# EAGLE design adaptor (EAGLE 6.4)
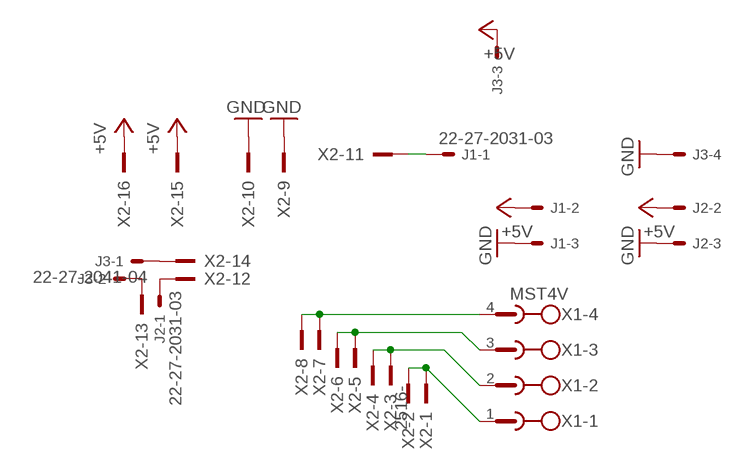
[diagram p0: schematic, sheet 1]

## Parts
J1  22-27-2031-03  [6410-03]
J2  22-27-2031-03  [6410-03]
J3  22-27-2041-04  [6410-04]
X1  MST4V  [MSTBV4]
X2  2516-  [PAK100/2500-16]

## Nets
+5V: J1.2 J2.2 J3.3 X2.15 X2.16
GND: J1.3 J2.3 J3.4 X2.9 X2.10
N$1: X1.4 X2.7 X2.8
N$2: X1.3 X2.5 X2.6
N$3: X1.2 X2.3 X2.4
N$4: X1.1 X2.1 X2.2
N$5: J1.1 X2.11
N$6: J3.1 X2.14
N$7: J2.1 X2.12
N$8: J3.2 X2.13

## Library data of the parts
J1 J2 = con-molex:22-?-03: CONNECTOR wire to board 2.54 mm (.1 inch) pitch header; OC_FARNELL: unknown; OC_NEWARK: unknown
J3 = con-molex:22-?-04: CONNECTOR wire to board 2.54 mm (.1 inch) pitch header; OC_FARNELL: unknown; OC_NEWARK: unknown
X1 = con-phoenix-508:MST4V: PHOENIX; OC_FARNELL: unknown; OC_NEWARK: unknown
X2 = con-3m:2516-: 3M (TM) Pak 100 4-Wall Header Source: 3M; OC_FARNELL: unknown; OC_NEWARK: unknown

## Board
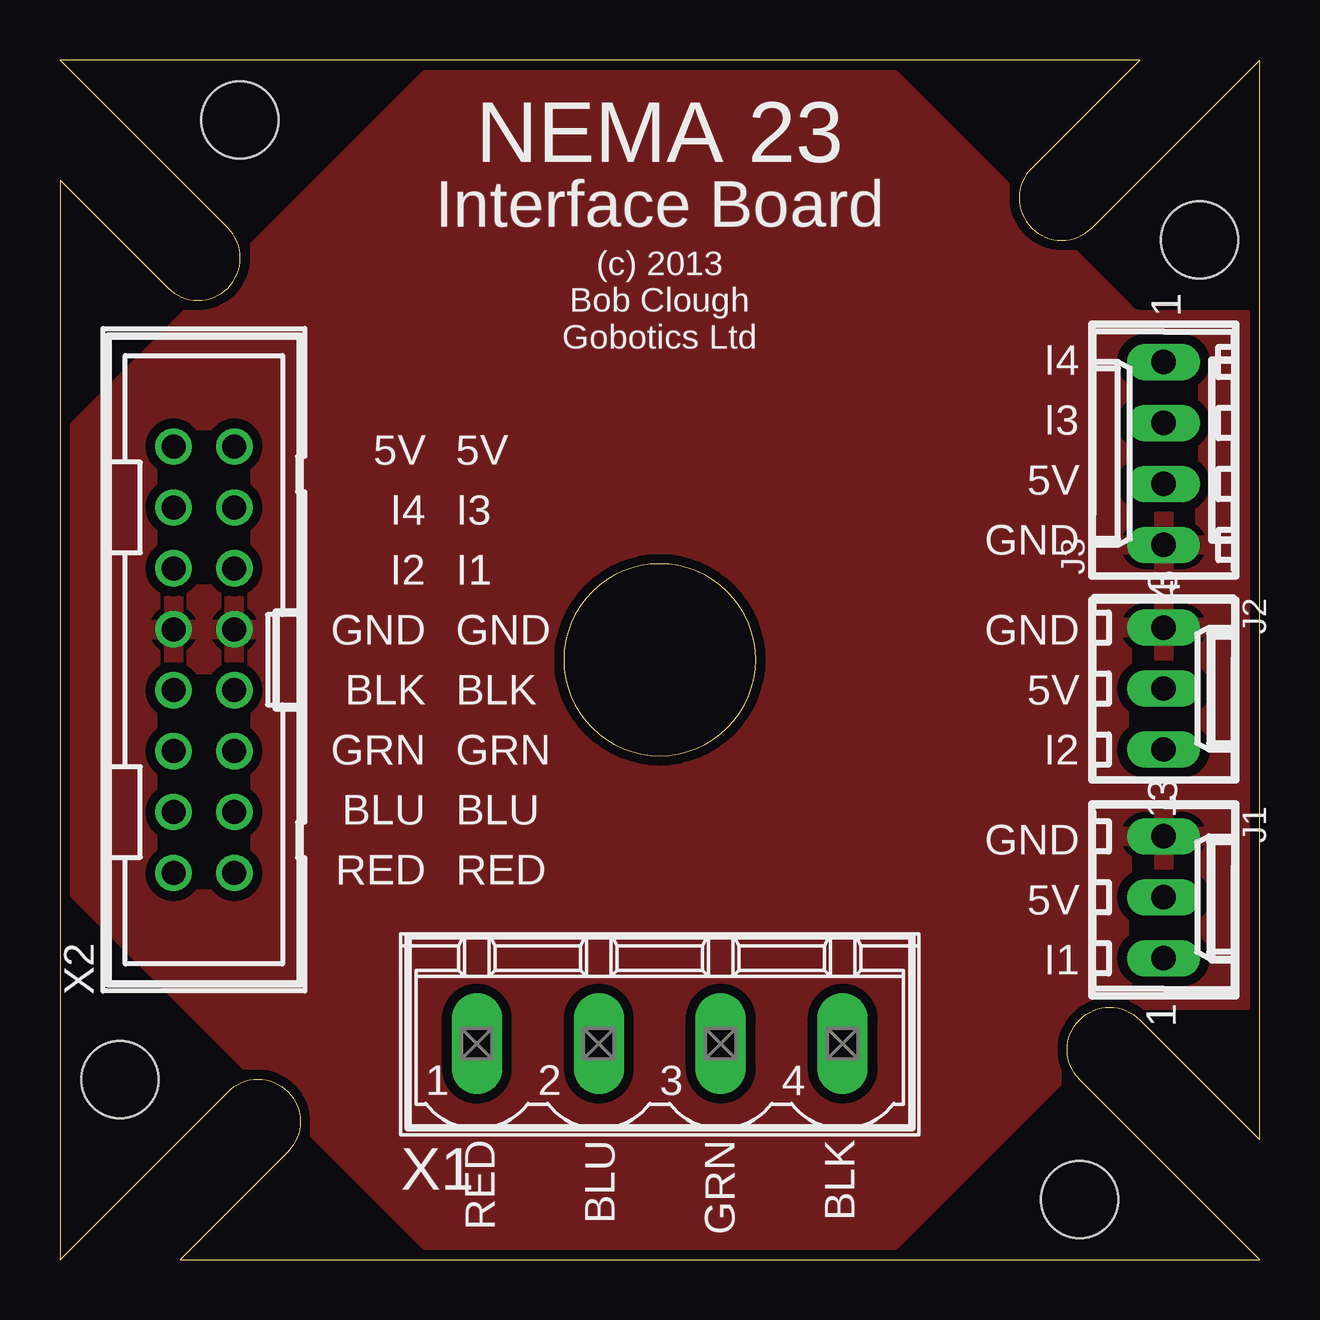
[diagram p1: board, top side]
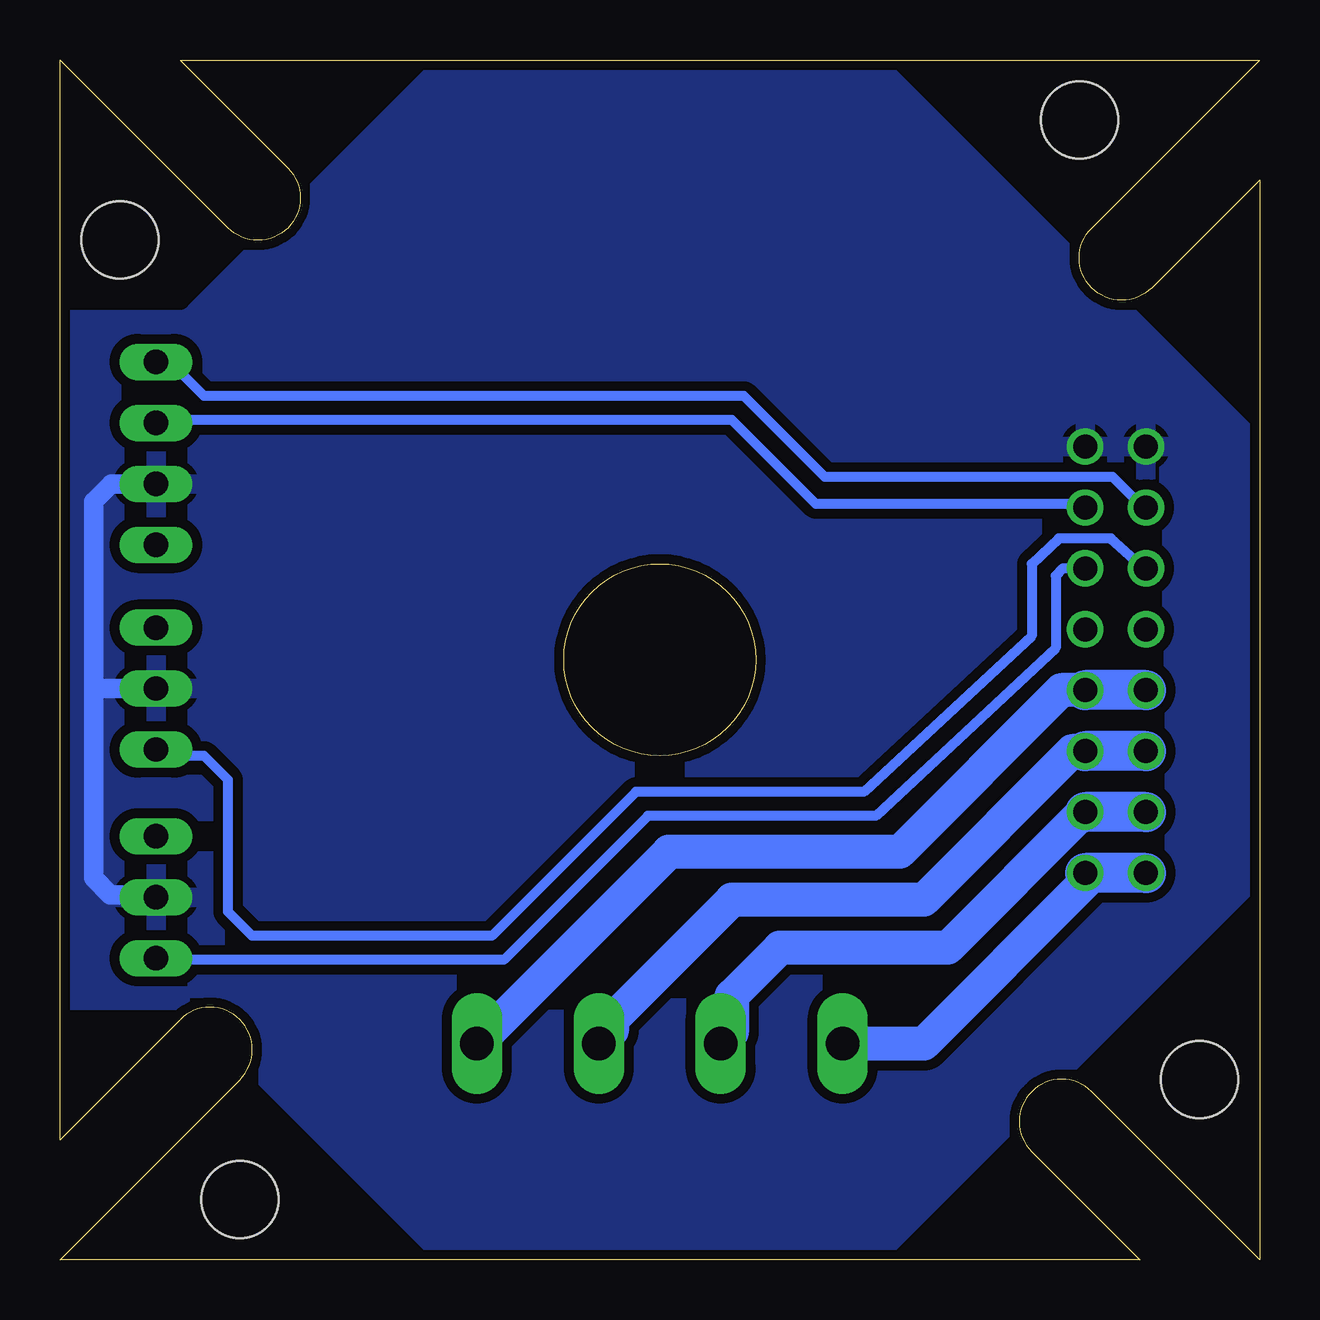
[diagram p2: board, bottom side, seen from below]

Size 50 x 50 mm. Coordinates in mm from the lower left corner, seen from the top.
Outline: 5,0 50,0 42.5,7.5 arc-180 45,10 50,5 50,50 43,43 arc-180 40.5,45.5 45,50 0,50 7,43 arc-180 4.5,40.5 0,45 0,0 7,7 arc-180 9.5,4.5 5,0
Outline: 21,25 arc180 29,25 arc180 21,25
Copper layers (1*16): Top 0.035mm / dielectric 1.5mm / Bottom 0.035mm
Design rules "Seeed Fusion Design Rules": minimum track width 6mil, minimum drill 12mil, track to track 6mil, track to pad 6mil, pad to pad 6mil, via to via 6mil, smd to smd 0mil, copper to edge 10mil, drill to drill 10mil, minimum pad ring 10mil, minimum via ring 6mil, stop-mask expansion 2mil, vias tented up to drill 100mil, thermal gap 10mil
Holes 3.2 mm at 2.5,7.5 7.5,47.5 47.5,42.5 42.5,2.5
tRestrict: area 0,0 to 15,15; area 0,35 to 15,50; area 35,40 to 50,50; area 35,0 to 50,10
bRestrict: area 0,35 to 15,50; area 35,40 to 50,50; area 35,0 to 50,10; area 0,0 to 15,15

### Footprints (pad centres in the part's own frame; a part is rotated, then mirrored left to right if it is on the bottom)
6410-03 = drill 1.016 long: 1 2.54,0; 2 0,0; 3 -2.54,0
6410-04 = drill 1.016 long: 1 3.81,0; 2 1.27,0; 3 -1.27,0; 4 -3.81,0
MSTBV4 = drill 1.397 long: 1 -7.62,0; 2 -2.54,0; 3 2.54,0; 4 7.62,0
PAK100/2500-16 = drill 1 pad 1.422: 1 -8.89,-1.27; 2 -8.89,1.27; 3 -6.35,-1.27; 4 -6.35,1.27; 5 -3.81,-1.27; 6 -3.81,1.27; 7 -1.27,-1.27; 8 -1.27,1.27; 9 1.27,-1.27; 10 1.27,1.27; 11 3.81,-1.27; 12 3.81,1.27; 13 6.35,-1.27; 14 6.35,1.27; 15 8.89,-1.27; 16 8.89,1.27

### Placement (x,y rotation side)
J1  46,15.1 270 top
J2  46,23.8 270 top
J3  46,33.6 90 top
X1  25,9 0 top
X2  6,25 90 top

### Tracks (layer width: path | path; a pad name or v marks a point on that pad's centre or on a via)
+5V
  Bottom 0.813: J3.3 47.87,32.33 48.6,31.6 48.6,23.8 | 48.6,23.8 48.6,15.9 47.9,15.2 46.1,15.2 J1.2 | J2.2 48.6,23.8
  pour Bottom (isolate 0.406): -2,53 53,53 59,47 59,1 48,-10 5,-10 -6,1
GND
  pour Top (isolate 0.406): -2.4,53.4 52.1,53.4 62.8,42.7 62.8,11.3 49.4,-2.1 2.8,-2.1 -4.9,5.6
N$1
  Bottom 1.422: X2.7 8.27,23.73 15,17 24.62,17 X1.4
  Bottom 1.676: X2.8 X2.7
N$2
  Bottom 1.422: X2.5 7.81,21.19 14,15 22,15 27,10 27,9.54 X1.3
  Bottom 1.676: X2.6 X2.5
N$3
  Bottom 1.422: X2.3 7.35,18.65 13,13 20,13 22,11 22,9.46 X1.2
  Bottom 1.676: X2.4 X2.3 | X1.2 22.46,9.54
N$4
  Bottom 1.422: X2.1 7.27,15.73 14,9 X1.1
  Bottom 1.676: X2.2 X2.1
N$5
  Bottom 0.406: X2.11 8.19,28.81 8.5,28.5 8.5,25.5 16,18.5 25.5,18.5 31.5,12.5 45.94,12.5
  Bottom 0.813: 45.94,12.5 J1.1
N$6
  Bottom 0.406: X2.14 4.85,31.35 6.12,32.62 18.12,32.62 21.5,36 44,36 45.5,37.5 45.91,37.5 J3.1
N$7
  Bottom 0.406: X2.12 4.81,28.81 6.19,30.06 8.38,30.06 9.5,29 9.5,26 16.5,19.5 26,19.5 32,13.5 42,13.5 43,14.5 43,20 44,21 45.74,21 J2.1
N$8
  Bottom 0.406: X2.13 7.35,31.35 7.5,31.5 18.5,31.5 22,35 45.87,35 J3.2

### Text on the board
_tsilk: NEMA 23 | Interface Board | (c) 2013 / Bob Clough / Gobotics Ltd | I4 | I3 | 5V | 5V | 5V | I4 | I3 | GND | I2 | I1 | I1 | GND | GND | GND | BLK | BLK | 5V | GRN | GRN | I2 | BLU | BLU | GND | RED | RED | 5V | I1 | RED | BLU | GRN | BLK